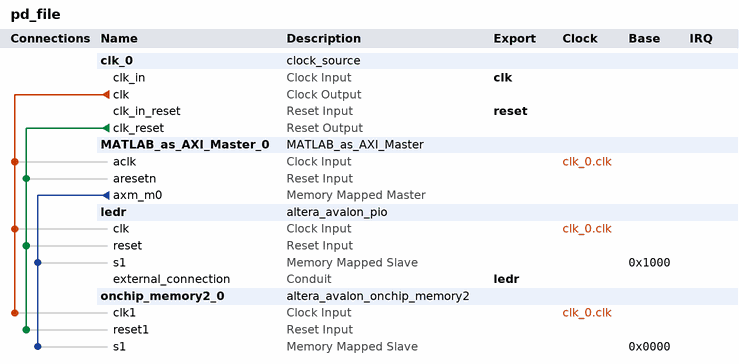
[diagram p0: system contents]
# Platform Designer (Qsys) system pd_file, Cyclone IV E EP4CE22F17C6
# Parameters at their usual value, and those the tool derives, are not listed.
package require -exact qsys 20.1
create_system pd_file
set_project_property DEVICE_FAMILY {Cyclone IV E}
set_project_property DEVICE EP4CE22F17C6

add_instance clk_0 clock_source 20.1
set_instance_parameter_value clk_0 clockFrequency 50000000

add_instance MATLAB_as_AXI_Master_0 MATLAB_as_AXI_Master 1.1
set_instance_parameter_value MATLAB_as_AXI_Master_0 AXI_ADDR_WIDTH 32
set_instance_parameter_value MATLAB_as_AXI_Master_0 AXI_DATA_WIDTH 32
set_instance_parameter_value MATLAB_as_AXI_Master_0 ID_WIDTH 1
set_instance_parameter_value MATLAB_as_AXI_Master_0 JTAG_ID 56

add_instance ledr altera_avalon_pio 20.1
set_instance_parameter_value ledr direction Output
set_instance_parameter_value ledr width 8

add_instance onchip_memory2_0 altera_avalon_onchip_memory2 20.1
set_instance_parameter_value onchip_memory2_0 dataWidth 32
set_instance_parameter_value onchip_memory2_0 dualPort false
set_instance_parameter_value onchip_memory2_0 initMemContent true
set_instance_parameter_value onchip_memory2_0 initializationFileName onchip_mem.hex
set_instance_parameter_value onchip_memory2_0 memorySize 4096

# connections
add_connection clk_0.clk ledr.clk clock
add_connection clk_0.clk MATLAB_as_AXI_Master_0.aclk clock
add_connection clk_0.clk onchip_memory2_0.clk1 clock
add_connection clk_0.clk_reset ledr.reset reset
add_connection clk_0.clk_reset MATLAB_as_AXI_Master_0.aresetn reset
add_connection clk_0.clk_reset onchip_memory2_0.reset1 reset
add_connection MATLAB_as_AXI_Master_0.axm_m0 ledr.s1 avalon
set_connection_parameter_value MATLAB_as_AXI_Master_0.axm_m0/ledr.s1 baseAddress 0x1000
add_connection MATLAB_as_AXI_Master_0.axm_m0 onchip_memory2_0.s1 avalon
set_connection_parameter_value MATLAB_as_AXI_Master_0.axm_m0/onchip_memory2_0.s1 baseAddress 0x0000

# exported interfaces
add_interface clk clock sink
set_interface_property clk EXPORT_OF clk_0.clk_in
add_interface ledr conduit end
set_interface_property ledr EXPORT_OF ledr.external_connection
add_interface reset reset sink
set_interface_property reset EXPORT_OF clk_0.clk_in_reset

set_interconnect_requirement {$system} qsys_mm.clockCrossingAdapter HANDSHAKE
set_interconnect_requirement {$system} qsys_mm.enableEccProtection FALSE
set_interconnect_requirement {$system} qsys_mm.insertDefaultSlave FALSE
set_interconnect_requirement {$system} qsys_mm.maxAdditionalLatency 1

save_system pd_file.qsys
